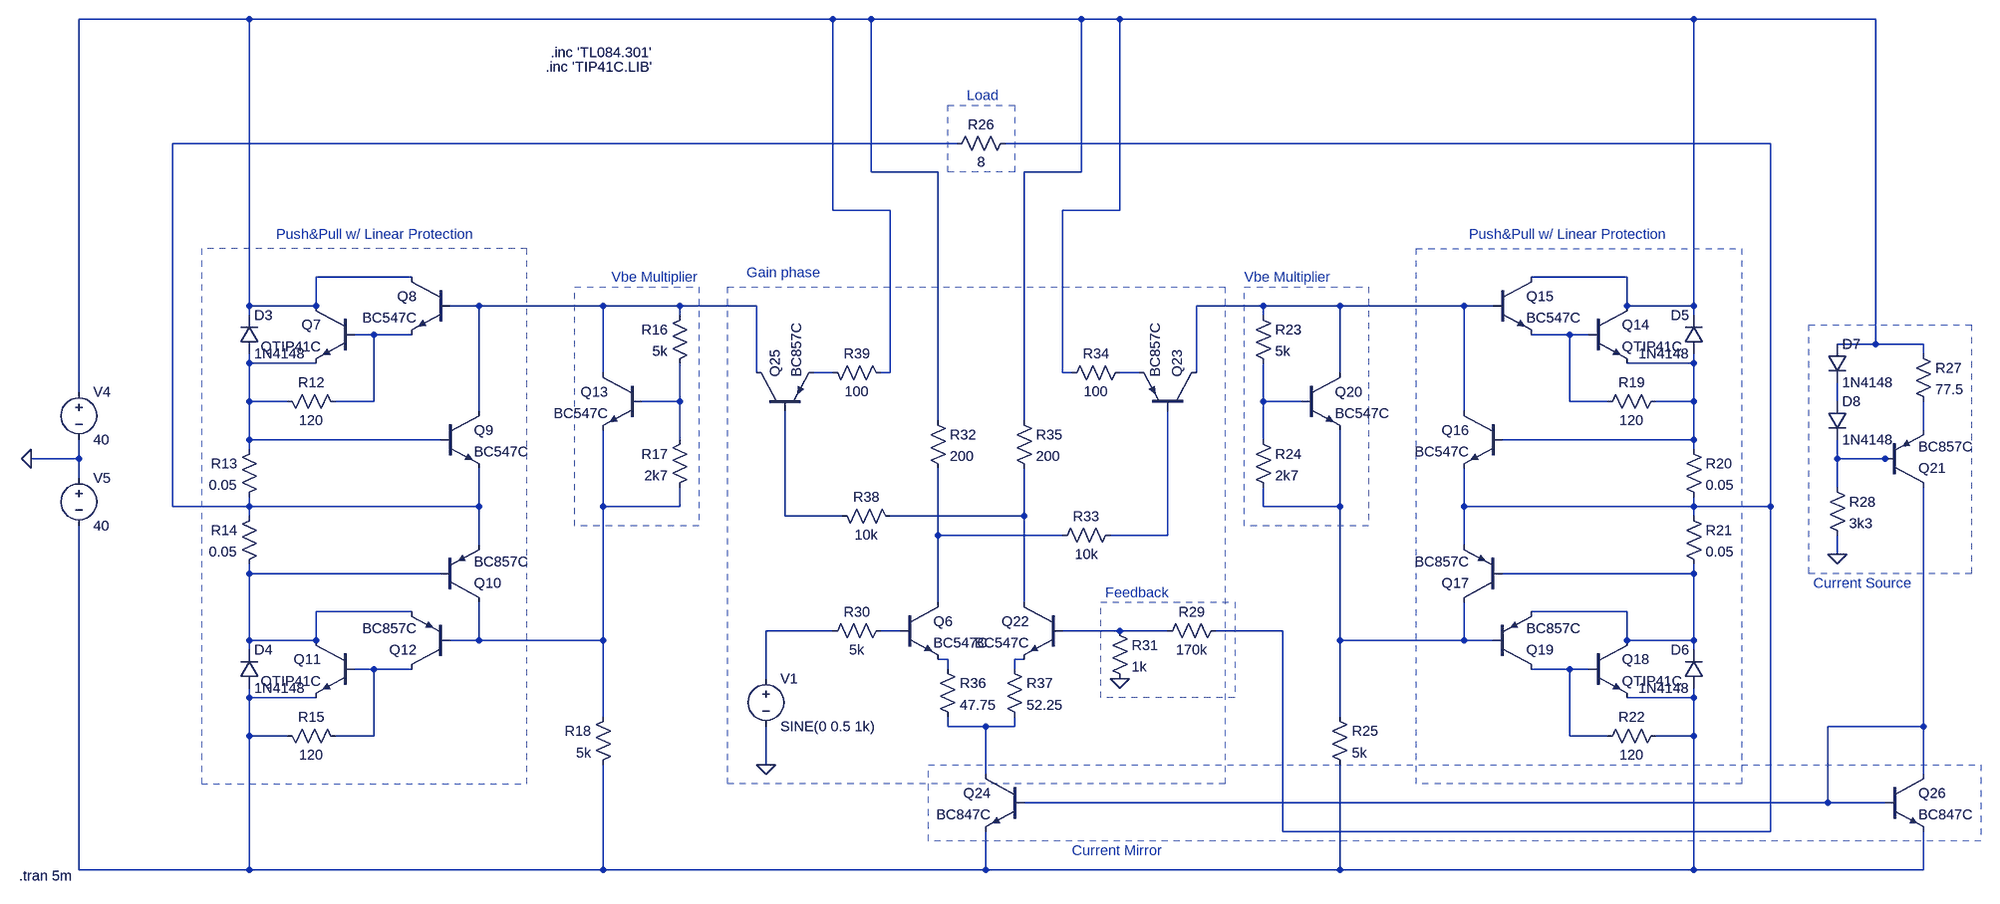
[diagram p0: schematic V2.asc]
V2.asc, the LTspice schematic file:
Version 4
SHEET 1 1992 680
WIRE -1072 -800 -1392 -800
WIRE -96 -800 -1072 -800
WIRE -32 -800 -96 -800
WIRE 320 -800 -32 -800
WIRE 384 -800 320 -800
WIRE 1344 -800 384 -800
WIRE 1648 -800 1344 -800
WIRE 112 -592 -1200 -592
WIRE 1472 -592 192 -592
WIRE -32 -544 -32 -800
WIRE 80 -544 -32 -544
WIRE 320 -544 320 -800
WIRE 320 -544 224 -544
WIRE -96 -480 -96 -800
WIRE 0 -480 -96 -480
WIRE 384 -480 384 -800
WIRE 384 -480 288 -480
WIRE -800 -368 -960 -368
WIRE 1232 -368 1072 -368
WIRE -1072 -320 -1072 -800
WIRE -960 -320 -960 -368
WIRE -960 -320 -1072 -320
WIRE -688 -320 -736 -320
WIRE -480 -320 -688 -320
WIRE -352 -320 -480 -320
WIRE -224 -320 -352 -320
WIRE 624 -320 512 -320
WIRE 752 -320 624 -320
WIRE 960 -320 752 -320
WIRE 1008 -320 960 -320
WIRE 1232 -320 1232 -368
WIRE 1344 -320 1344 -800
WIRE 1344 -320 1232 -320
WIRE -1072 -304 -1072 -320
WIRE -352 -304 -352 -320
WIRE 624 -304 624 -320
WIRE 1344 -304 1344 -320
WIRE -864 -272 -896 -272
WIRE -800 -272 -864 -272
WIRE 1136 -272 1072 -272
WIRE 1168 -272 1136 -272
WIRE 1648 -256 1648 -800
WIRE 1648 -256 1584 -256
WIRE 1728 -256 1648 -256
WIRE 1728 -240 1728 -256
WIRE -1072 -224 -1072 -240
WIRE -960 -224 -1072 -224
WIRE 1344 -224 1344 -240
WIRE 1344 -224 1232 -224
WIRE -480 -208 -480 -320
WIRE -224 -208 -224 -320
WIRE -96 -208 -128 -208
WIRE 0 -208 0 -480
WIRE 0 -208 -16 -208
WIRE 288 -208 288 -480
WIRE 304 -208 288 -208
WIRE 416 -208 384 -208
WIRE 512 -208 512 -320
WIRE 752 -208 752 -320
WIRE -1392 -176 -1392 -800
WIRE -1072 -160 -1072 -224
WIRE -1008 -160 -1072 -160
WIRE -864 -160 -864 -272
WIRE -864 -160 -928 -160
WIRE -352 -160 -352 -224
WIRE -352 -160 -416 -160
WIRE 624 -160 624 -224
WIRE 688 -160 624 -160
WIRE 1136 -160 1136 -272
WIRE 1200 -160 1136 -160
WIRE 1344 -160 1344 -224
WIRE 1344 -160 1280 -160
WIRE 1584 -160 1584 -192
WIRE -688 -144 -688 -320
WIRE 960 -144 960 -320
WIRE 80 -128 80 -544
WIRE 224 -128 224 -544
WIRE 1728 -112 1728 -160
WIRE -1072 -96 -1072 -160
WIRE -752 -96 -1072 -96
WIRE -352 -96 -352 -160
WIRE 624 -96 624 -160
WIRE 1344 -96 1344 -160
WIRE 1344 -96 1024 -96
WIRE -1072 -80 -1072 -96
WIRE 1344 -80 1344 -96
WIRE -1392 -64 -1392 -96
WIRE -1392 -64 -1472 -64
WIRE 1584 -64 1584 -96
WIRE 1664 -64 1584 -64
WIRE 1680 -64 1664 -64
WIRE -1392 -32 -1392 -64
WIRE 1584 -16 1584 -64
WIRE -1200 16 -1200 -592
WIRE -1072 16 -1072 0
WIRE -1072 16 -1200 16
WIRE -688 16 -688 -48
WIRE -688 16 -1072 16
WIRE -480 16 -480 -112
WIRE -352 16 -352 -16
WIRE -352 16 -480 16
WIRE 624 16 624 -16
WIRE 752 16 752 -112
WIRE 752 16 624 16
WIRE 960 16 960 -48
WIRE 1344 16 1344 0
WIRE 1344 16 960 16
WIRE 1472 16 1472 -592
WIRE 1472 16 1344 16
WIRE -1072 32 -1072 16
WIRE -176 32 -176 -144
WIRE -80 32 -176 32
WIRE 224 32 224 -48
WIRE 224 32 0 32
WIRE 1344 32 1344 16
WIRE 80 64 80 -48
WIRE 288 64 80 64
WIRE 464 64 464 -144
WIRE 464 64 368 64
WIRE -688 80 -688 16
WIRE 960 80 960 16
WIRE 1584 96 1584 64
WIRE -1072 128 -1072 112
WIRE -752 128 -1072 128
WIRE 1344 128 1344 112
WIRE 1344 128 1024 128
WIRE 80 176 80 64
WIRE 224 176 224 32
WIRE -800 192 -960 192
WIRE 1232 192 1072 192
WIRE -96 224 -208 224
WIRE 16 224 -16 224
WIRE 384 224 288 224
WIRE 464 224 384 224
WIRE 656 224 544 224
WIRE -1072 240 -1072 128
WIRE -960 240 -960 192
WIRE -960 240 -1072 240
WIRE -688 240 -688 176
WIRE -688 240 -736 240
WIRE -480 240 -480 16
WIRE -480 240 -688 240
WIRE 752 240 752 16
WIRE 960 240 960 176
WIRE 960 240 752 240
WIRE 1008 240 960 240
WIRE 1232 240 1232 192
WIRE 1344 240 1344 128
WIRE 1344 240 1232 240
WIRE -1072 256 -1072 240
WIRE 1344 256 1344 240
WIRE 96 272 80 272
WIRE 224 272 208 272
WIRE -864 288 -896 288
WIRE -800 288 -864 288
WIRE 96 288 96 272
WIRE 208 288 208 272
WIRE 1136 288 1072 288
WIRE 1168 288 1136 288
WIRE -208 304 -208 224
WIRE -1072 336 -1072 320
WIRE -960 336 -1072 336
WIRE 1344 336 1344 320
WIRE 1344 336 1232 336
WIRE -480 368 -480 240
WIRE 752 368 752 240
WIRE 96 384 96 368
WIRE 160 384 96 384
WIRE 208 384 208 368
WIRE 208 384 160 384
WIRE 1728 384 1728 -16
WIRE 1728 384 1568 384
WIRE -1072 400 -1072 336
WIRE -1008 400 -1072 400
WIRE -864 400 -864 288
WIRE -864 400 -928 400
WIRE 1136 400 1136 288
WIRE 1200 400 1136 400
WIRE 1344 400 1344 336
WIRE 1344 400 1280 400
WIRE -208 448 -208 384
WIRE 160 464 160 384
WIRE 1728 464 1728 384
WIRE 1568 512 1568 384
WIRE 1568 512 224 512
WIRE 1664 512 1568 512
WIRE 656 560 656 224
WIRE 1472 560 1472 16
WIRE 1472 560 656 560
WIRE -1392 624 -1392 48
WIRE -1072 624 -1072 400
WIRE -1072 624 -1392 624
WIRE -480 624 -480 448
WIRE -480 624 -1072 624
WIRE 160 624 160 560
WIRE 160 624 -480 624
WIRE 752 624 752 448
WIRE 752 624 160 624
WIRE 1344 624 1344 400
WIRE 1344 624 752 624
WIRE 1728 624 1728 560
WIRE 1728 624 1344 624
FLAG 1584 96 0
FLAG -1472 -64 0
FLAG -208 448 0
FLAG 384 304 0
SYMBOL npn -896 -320 M0
SYMATTR InstName Q7
SYMATTR Value QTIP41C
SYMBOL npn -736 -368 M0
SYMATTR InstName Q8
SYMATTR Value BC547C
SYMBOL diode -1088 -240 M180
WINDOW 0 24 64 Left 2
WINDOW 3 24 0 Left 2
SYMATTR InstName D3
SYMATTR Value 1N4148
SYMBOL res -1024 -176 M90
WINDOW 0 0 56 VBottom 2
WINDOW 3 32 56 VTop 2
SYMATTR InstName R12
SYMATTR Value 120
SYMBOL npn -752 -144 R0
SYMATTR InstName Q9
SYMATTR Value BC547C
SYMBOL res -1056 -96 M0
SYMATTR InstName R13
SYMATTR Value 0.05
SYMBOL res -1056 16 M0
SYMATTR InstName R14
SYMATTR Value 0.05
SYMBOL pnp -752 176 M180
SYMATTR InstName Q10
SYMATTR Value BC857C
SYMBOL npn -896 240 M0
SYMATTR InstName Q11
SYMATTR Value QTIP41C
SYMBOL diode -1088 320 M180
WINDOW 0 24 64 Left 2
WINDOW 3 24 0 Left 2
SYMATTR InstName D4
SYMATTR Value 1N4148
SYMBOL res -1024 384 M90
WINDOW 0 0 56 VBottom 2
WINDOW 3 32 56 VTop 2
SYMATTR InstName R15
SYMATTR Value 120
SYMBOL pnp -736 288 R180
SYMATTR InstName Q12
SYMATTR Value BC857C
SYMBOL npn -416 -208 M0
SYMATTR InstName Q13
SYMATTR Value BC547C
SYMBOL res -336 -320 M0
SYMATTR InstName R16
SYMATTR Value 5k
SYMBOL res -336 -112 M0
SYMATTR InstName R17
SYMATTR Value 2k7
SYMBOL res -464 352 M0
SYMATTR InstName R18
SYMATTR Value 5k
SYMBOL npn 1168 -320 R0
SYMATTR InstName Q14
SYMATTR Value QTIP41C
SYMBOL npn 1008 -368 R0
SYMATTR InstName Q15
SYMATTR Value BC547C
SYMBOL diode 1360 -240 R180
WINDOW 0 24 64 Left 2
WINDOW 3 24 0 Left 2
SYMATTR InstName D5
SYMATTR Value 1N4148
SYMBOL res 1296 -176 R90
WINDOW 0 0 56 VBottom 2
WINDOW 3 32 56 VTop 2
SYMATTR InstName R19
SYMATTR Value 120
SYMBOL npn 1024 -144 M0
SYMATTR InstName Q16
SYMATTR Value BC547C
SYMBOL res 1328 -96 R0
SYMATTR InstName R20
SYMATTR Value 0.05
SYMBOL res 1328 16 R0
SYMATTR InstName R21
SYMATTR Value 0.05
SYMBOL pnp 1024 176 R180
SYMATTR InstName Q17
SYMATTR Value BC857C
SYMBOL npn 1168 240 R0
SYMATTR InstName Q18
SYMATTR Value QTIP41C
SYMBOL diode 1360 320 R180
WINDOW 0 24 64 Left 2
WINDOW 3 24 0 Left 2
SYMATTR InstName D6
SYMATTR Value 1N4148
SYMBOL res 1296 384 R90
WINDOW 0 0 56 VBottom 2
WINDOW 3 32 56 VTop 2
SYMATTR InstName R22
SYMATTR Value 120
SYMBOL pnp 1008 288 M180
SYMATTR InstName Q19
SYMATTR Value BC857C
SYMBOL npn 688 -208 R0
SYMATTR InstName Q20
SYMATTR Value BC547C
SYMBOL res 608 -320 R0
SYMATTR InstName R23
SYMATTR Value 5k
SYMBOL res 608 -112 R0
SYMATTR InstName R24
SYMATTR Value 2k7
SYMBOL res 736 352 R0
SYMATTR InstName R25
SYMATTR Value 5k
SYMBOL res 208 -608 R90
WINDOW 0 0 56 VBottom 2
WINDOW 3 32 56 VTop 2
SYMATTR InstName R26
SYMATTR Value 8
SYMBOL pnp 1664 -16 M180
SYMATTR InstName Q21
SYMATTR Value BC857C
SYMBOL res 1712 -256 R0
SYMATTR InstName R27
SYMATTR Value 77.5
SYMBOL res 1568 -32 R0
SYMATTR InstName R28
SYMATTR Value 3k3
SYMBOL diode 1568 -256 R0
SYMATTR InstName D7
SYMATTR Value 1N4148
SYMBOL diode 1568 -160 R0
SYMATTR InstName D8
SYMATTR Value 1N4148
SYMBOL voltage -1392 -192 R0
WINDOW 123 0 0 Left 0
WINDOW 39 0 0 Left 0
SYMATTR InstName V4
SYMATTR Value 40
SYMBOL voltage -1392 -48 R0
WINDOW 123 0 0 Left 0
WINDOW 39 0 0 Left 0
SYMATTR InstName V5
SYMATTR Value 40
SYMBOL npn 16 176 R0
SYMATTR InstName Q6
SYMATTR Value BC547C
SYMBOL npn 288 176 M0
SYMATTR InstName Q22
SYMATTR Value BC547C
SYMBOL res 560 208 R90
WINDOW 0 0 56 VBottom 2
WINDOW 3 32 56 VTop 2
SYMATTR InstName R29
SYMATTR Value 170k
SYMBOL res 0 208 R90
WINDOW 0 0 56 VBottom 2
WINDOW 3 32 56 VTop 2
SYMATTR InstName R30
SYMATTR Value 5k
SYMBOL res 368 208 R0
SYMATTR InstName R31
SYMATTR Value 1k
SYMBOL res 64 -144 R0
SYMATTR InstName R32
SYMATTR Value 200
SYMBOL pnp 512 -144 M270
SYMATTR InstName Q23
SYMATTR Value BC857C
SYMBOL res 384 48 R90
WINDOW 0 0 56 VBottom 2
WINDOW 3 32 56 VTop 2
SYMATTR InstName R33
SYMATTR Value 10k
SYMBOL res 288 -192 R270
WINDOW 0 32 56 VTop 2
WINDOW 3 0 56 VBottom 2
SYMATTR InstName R34
SYMATTR Value 100
SYMBOL npn 224 464 M0
SYMATTR InstName Q24
SYMATTR Value BC847C
SYMBOL res 208 -144 R0
SYMATTR InstName R35
SYMATTR Value 200
SYMBOL res 80 272 R0
SYMATTR InstName R36
SYMATTR Value 47.75
SYMBOL res 192 272 R0
SYMATTR InstName R37
SYMATTR Value 52.25
SYMBOL voltage -208 288 R0
WINDOW 123 0 0 Left 0
WINDOW 39 0 0 Left 0
SYMATTR InstName V1
SYMATTR Value SINE(0 0.5 1k)
SYMBOL pnp -224 -144 R270
SYMATTR InstName Q25
SYMATTR Value BC857C
SYMBOL res -96 16 M90
WINDOW 0 0 56 VBottom 2
WINDOW 3 32 56 VTop 2
SYMATTR InstName R38
SYMATTR Value 10k
SYMBOL res 0 -192 M270
WINDOW 0 32 56 VTop 2
WINDOW 3 0 56 VBottom 2
SYMATTR InstName R39
SYMATTR Value 100
SYMBOL npn 1664 464 R0
SYMATTR InstName Q26
SYMATTR Value BC847C
TEXT -696 -440 Right 2 ;Push&Pull w/ Linear Protection
TEXT 968 -440 Left 2 ;Push&Pull w/ Linear Protection
TEXT 592 -368 Left 2 ;Vbe Multiplier
TEXT 128 -672 Left 2 ;Load
TEXT -568 -744 Left 2 !.inc 'TL084.301'
TEXT -320 -368 Right 2 ;Vbe Multiplier
TEXT 304 592 Left 2 ;Current Mirror
TEXT 1544 144 Left 2 ;Current Source
TEXT -240 -376 Left 2 ;Gain phase
TEXT 360 160 Left 2 ;Feedback
TEXT -576 -720 Left 2 !.inc 'TIP41C.LIB'
TEXT -1492 634 Left 2 !.tran 5m
RECTANGLE Normal -1152 480 -608 -416 2
RECTANGLE Normal 1424 480 880 -416 2
RECTANGLE Normal 208 -544 96 -656 2
RECTANGLE Normal 800 48 592 -352 2
RECTANGLE Normal -320 48 -528 -352 2
RECTANGLE Normal 1824 576 64 448 2
RECTANGLE Normal 1808 128 1536 -288 2
RECTANGLE Normal 560 480 -272 -352 2
RECTANGLE Normal 576 336 352 176 2

The netlist it stands for:
* V2.asc
Q7 N001 N006 N008 0 QTIP41C
Q8 N001 N004 N006 0 BC547C
D3 N008 N001 1N4148
R12 N008 N006 120
Q9 N004 N008 N002 0 BC547C
R13 N008 N002 0.05
R14 N002 N023 0.05
Q10 N017 N023 N002 0 BC857C
Q11 N023 N030 N032 0 QTIP41C
D4 N032 N023 1N4148
R15 N032 N030 120
Q12 N030 N017 N023 0 BC857C
Q13 N004 N012 N017 0 BC547C
R16 N004 N012 5k
R17 N012 N017 2k7
R18 N017 N032 5k
Q14 N001 N007 N009 0 QTIP41C
Q15 N001 N005 N007 0 BC547C
D5 N009 N001 1N4148
R19 N009 N007 120
Q16 N005 N009 N003 0 BC547C
R20 N009 N003 0.05
R21 N003 N024 0.05
Q17 N018 N024 N003 0 BC857C
Q18 N024 N031 N032 0 QTIP41C
D6 N032 N024 1N4148
R22 N032 N031 120
Q19 N031 N018 N024 0 BC857C
Q20 N005 N013 N018 0 BC547C
R23 N005 N013 5k
R24 N013 N018 2k7
R25 N018 N032 5k
R26 N003 N002 8
Q21 N034 N016 N015 0 BC857C
R27 N001 N015 77.5
R28 N016 0 3k3
D7 N001 N014 1N4148
D8 N014 N016 1N4148
V4 N001 0 40
V5 0 N032 40
Q6 N021 N026 N028 0 BC547C
Q22 N020 N027 N029 0 BC547C
R29 N003 N027 170k
R30 N026 N025 5k
R31 N027 0 1k
R32 N001 N021 200
Q23 N005 N022 N011 0 BC857C
R33 N022 N021 10k
R34 N001 N011 100
Q24 N033 N034 N032 0 BC847C
R35 N001 N020 200
R36 N028 N033 47.75
R37 N029 N033 52.25
V1 N025 0 SINE(0 0.5 1k)
Q25 N004 N019 N010 0 BC857C
R38 N019 N020 10k
R39 N001 N010 100
Q26 N034 N034 N032 0 BC847C
.model D D
.lib standard.dio
.model NPN NPN
.model PNP PNP
.lib standard.bjt
* Push&Pull w/ Linear Protection
* Push&Pull w/ Linear Protection
* Vbe Multiplier
* Load
.inc 'TL084.301'
* Vbe Multiplier
* Current Mirror
* Current Source
* Gain phase
* Feedback
.inc 'TIP41C.LIB'
.tran 5m
.backanno
.end